# EAGLE design daughter-double2 (EAGLE 6.6.0)
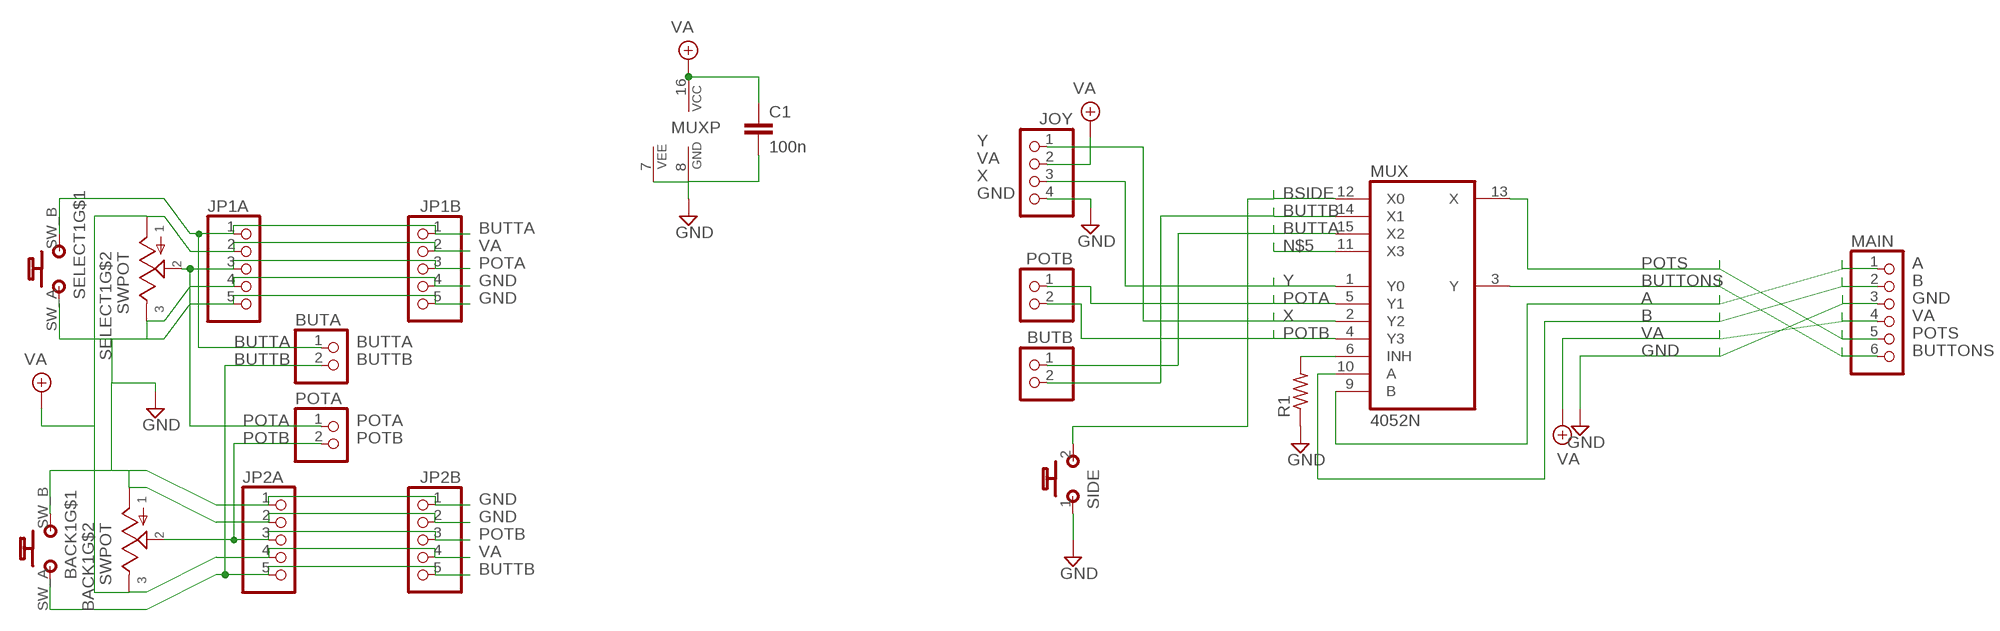
[diagram p0: schematic, sheet 1]

## Parts
BACK1  SWPOT  [SWPOT]
BUTA  PINHD-1X2  [1X02]
BUTB  PINHD-1X2  [1X02]
C1  100n  050X030_050  [050X030_050_3]
JOY  PINHD-1X4  [1X04]
JP1A  PINHD-1X5  [1X05]
JP1B  PINHD-1X5  [1X05]
JP2A  PINHD-1X5  [1X05]
JP2B  PINHD-1X5  [1X05]
MAIN  PINHD-1X6  [1X06]
MUX  4052N  [DIL16]
POTA  PINHD-1X2  [1X02]
POTB  PINHD-1X2  [1X02]
R1  6MM.1  [R0207/1V]
SELECT1  SWPOT  [SWPOT]
SIDE  MOMENTARYSPST1  [SPST]

## Nets
A: MAIN.1 MUX.9(B)
B: MAIN.2 MUX.10(A)
BSIDE: MUX.12(X0) SIDE.2(S)
BUTTA: BUTA.1 BUTB.1 JP1A.1 JP1B.1 MUX.15(X2) SELECT1.SW_B(B_B)
BUTTB: BACK1.SW_A(B_A) BUTA.2 BUTB.2 JP2A.5 JP2B.5 MUX.14(X1)
BUTTONS: MAIN.6 MUX.3(Y)
GND: BACK1.POT_B BACK1.SW_B(B_B) C1.2 JOY.4 JP1A.4 JP1A.5 JP1B.4 JP1B.5 JP2A.1 JP2A.2 JP2B.1 JP2B.2 MAIN.3 MUX.7(VEE) MUX.8(GND) R1.1 SELECT1.POT_A SELECT1.SW_A(B_A) SIDE.1(P)
N$5: MUX.11(X3)
N$6: MUX.6(INH) R1.2
POTA: JP1A.3 JP1B.3 MUX.5(Y1) POTA.1 POTB.1 SELECT1.POT_W
POTB: BACK1.POT_W JP2A.3 JP2B.3 MUX.4(Y3) POTA.2 POTB.2
POTS: MAIN.5 MUX.13(X)
VA: BACK1.POT_A C1.1 JOY.2 JP1A.2 JP1B.2 JP2A.4 JP2B.4 MAIN.4 MUX.16(VCC) SELECT1.POT_B
X: JOY.1 MUX.2(Y2)
Y: JOY.3 MUX.1(Y0)

## Library data of the parts
BACK1 SELECT1 = jaapie:SWPOT
BUTA BUTB POTA POTB = pinhead:PINHD-1X2: PIN HEADER
C1 = gm-caps-ceramic:050X030_050: 120 - 150pF Xicon Ceramic Disc 5mm lead spacing
JOY = pinhead:PINHD-1X4: PIN HEADER
JP1A JP1B JP2A JP2B = pinhead:PINHD-1X5: PIN HEADER
MAIN = pinhead:PINHD-1X6: PIN HEADER
MUX = 40xx:4052: Dual 4-channel ANALOG MULTIPLEXER
R1 = gm-resistors:6MM: 6mm Resistors Leads spaced 1-6 holes apart for 0.1" perfboard. Suitable for 1/4 watt resistors.
SIDE = gm-switches:MOMENTARY

## Board
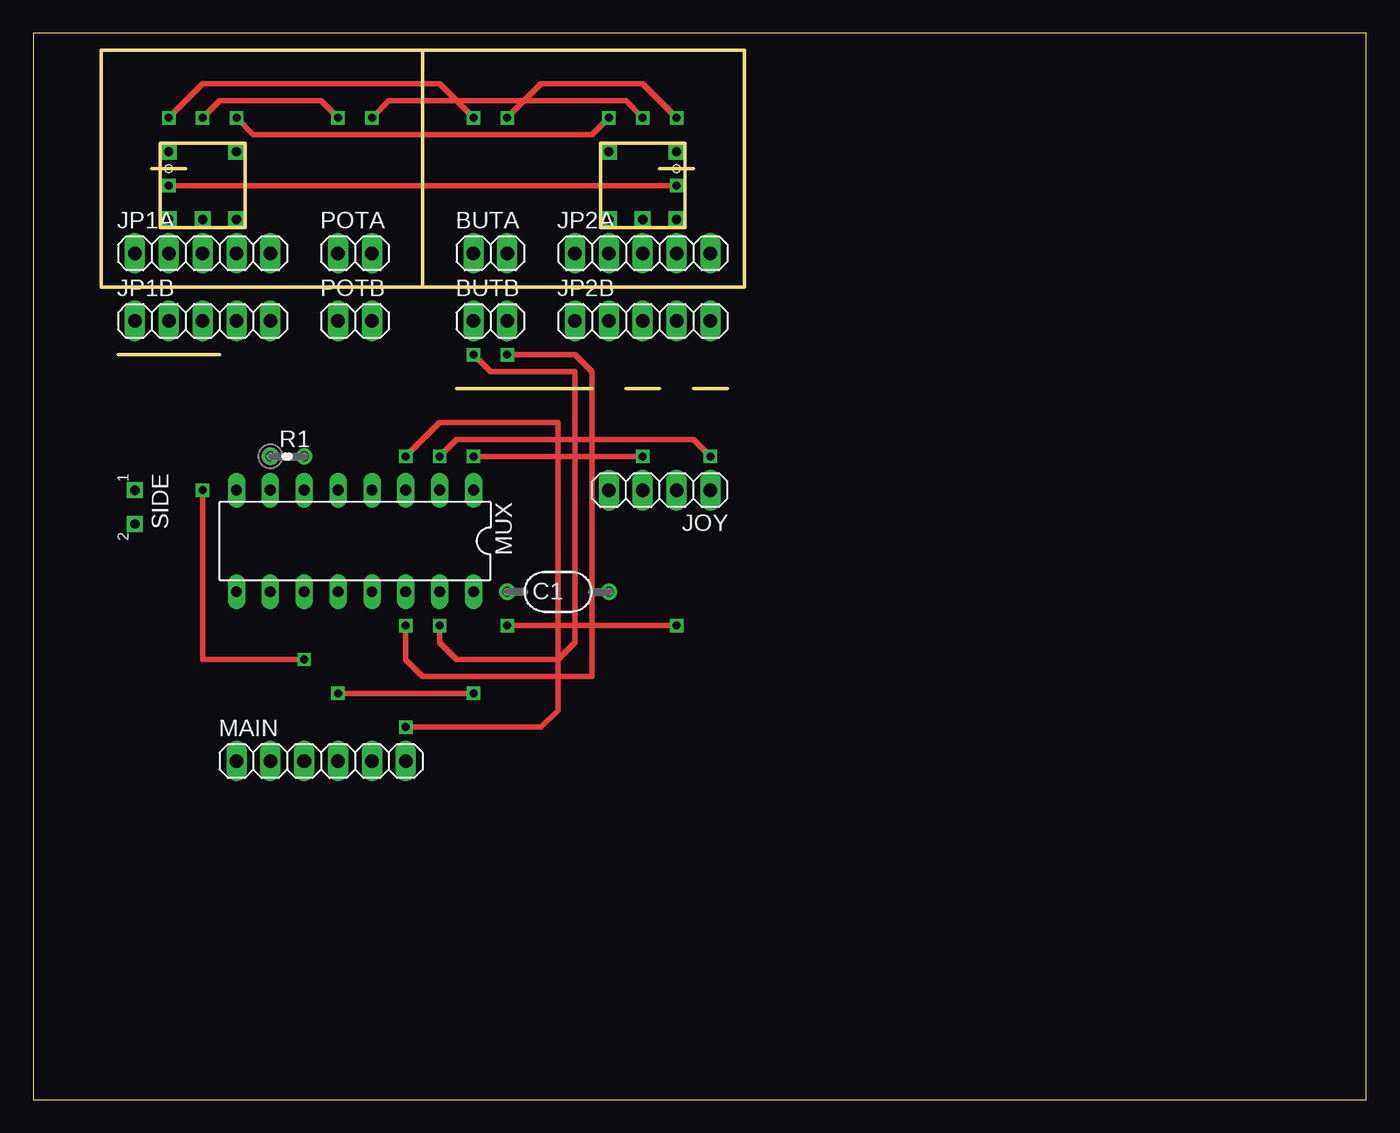
[diagram p1: board, top side]
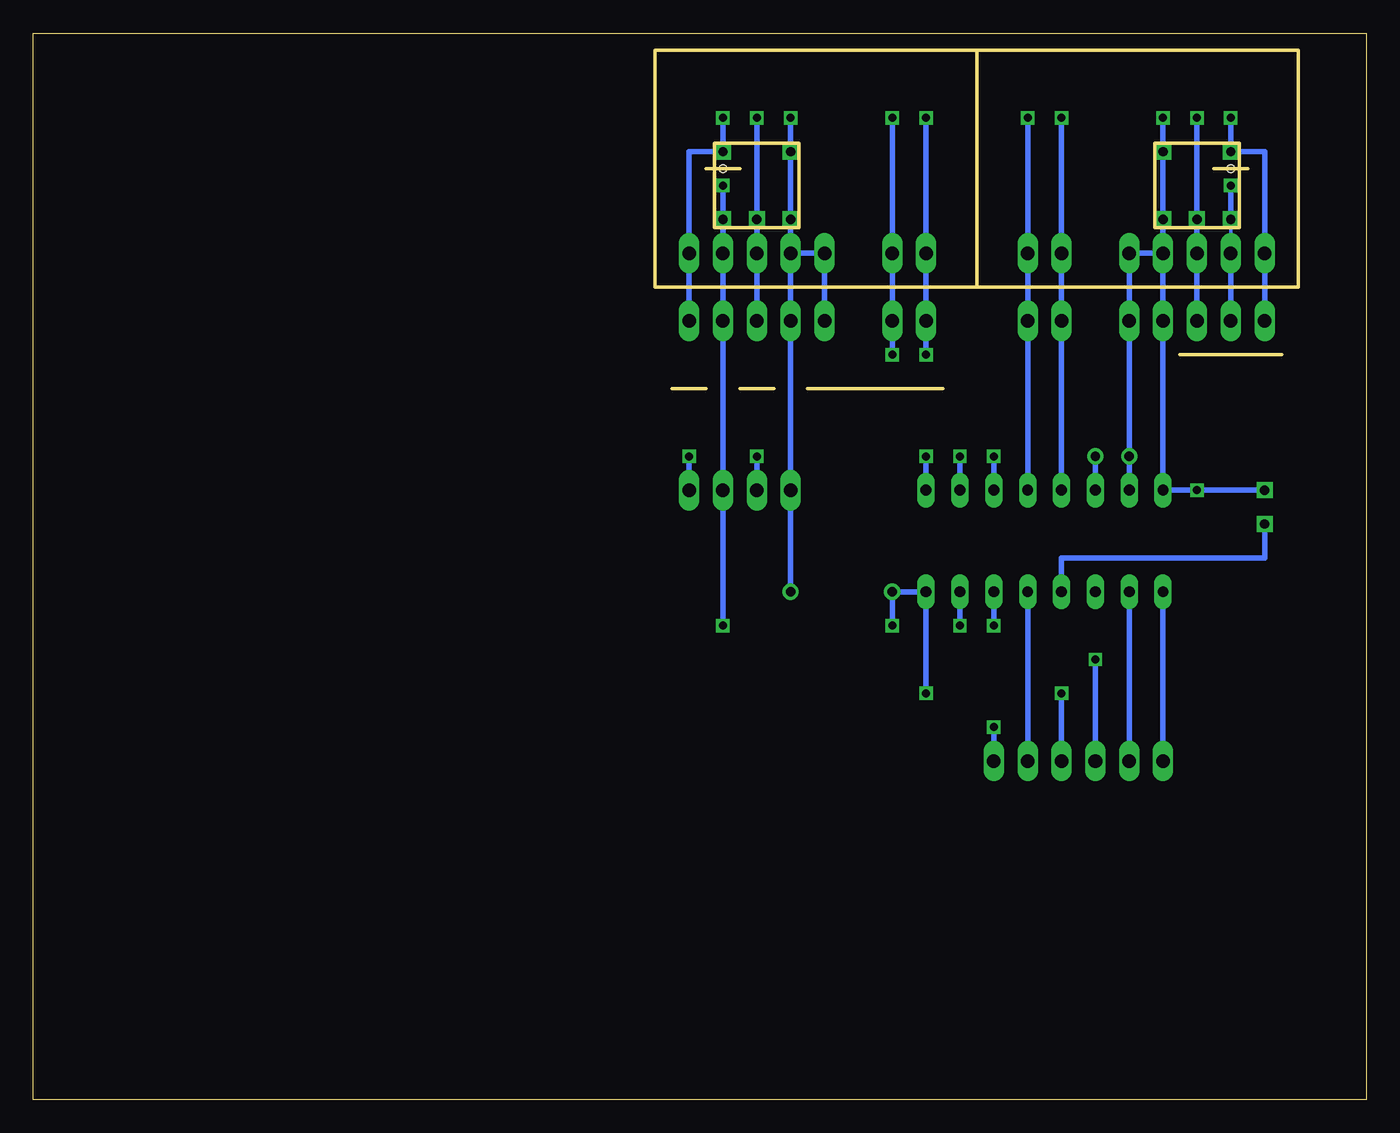
[diagram p2: board, bottom side, seen from below]

Size 100 x 80 mm. Coordinates in mm from the lower left corner, seen from the top.
Outline: 29.21,60.96 5.08,60.96 5.08,78.74 29.21,78.74
Outline: 29.21,60.96 53.34,60.96 53.34,78.74 29.21,78.74
Outline: 29.21,78.74 29.21,60.96
Outline: 8.89,69.85 11.43,69.85
Outline: 46.99,69.85 49.53,69.85
Outline: 6.35,55.88 13.97,55.88
Outline: 31.75,53.34 41.91,53.34
Outline: 44.45,53.34 46.99,53.34
Outline: 49.53,53.34 52.07,53.34
Outline: 0,0 100,0 100,80 0,80 0,0
Outline: 9.53,71.75 9.53,65.41 15.88,65.41 15.88,71.75 9.53,71.75
Outline: 42.55,71.75 48.9,71.75 48.9,65.41 42.55,65.41 42.55,71.75
Copper layers (1*16): Top 0.035mm / dielectric 1.5mm / Bottom 0.035mm
Design rules "default": minimum track width 10mil, minimum drill 24mil, track to track 8mil, track to pad 8mil, pad to pad 8mil, via to via 8mil, smd to smd 8mil, copper to edge 40mil, drill to drill 8mil, minimum pad ring 10mil, minimum via ring 8mil, stop-mask expansion 4mil, vias tented up to drill 0mil, thermal gap 10mil
Holes 0.6 mm at 10.16,69.85 48.26,69.85

### Footprints (pad centres in the part's own frame; a part is rotated, then mirrored left to right if it is on the bottom)
SWPOT = drill 0.7 square: POT_A -2.54,0; POT_B 2.54,0; POT_W 0,0; SW_A -2.54,-5.08; SW_B 2.54,-5.08
1X02 = drill 1.016 long: 1 -1.27,0; 2 1.27,0
050X030_050_3 = drill 0.7: 1 -3.81,0; 2 3.81,0
1X04 = drill 1.016 long: 1 -3.81,0; 2 -1.27,0; 3 1.27,0; 4 3.81,0
1X05 = drill 1.016 long: 1 -5.08,0; 2 -2.54,0; 3 0,0; 4 2.54,0; 5 5.08,0
1X06 = drill 1.016 long: 1 -6.35,0; 2 -3.81,0; 3 -1.27,0; 4 1.27,0; 5 3.81,0; 6 6.35,0
DIL16 = drill 0.813 long: 1 -8.89,-3.81; 2 -6.35,-3.81; 3 -3.81,-3.81; 4 -1.27,-3.81; 5 1.27,-3.81; 6 3.81,-3.81; 7 6.35,-3.81; 8 8.89,-3.81; 9 8.89,3.81; 10 6.35,3.81; 11 3.81,3.81; 12 1.27,3.81; 13 -1.27,3.81; 14 -3.81,3.81; 15 -6.35,3.81; 16 -8.89,3.81
R0207/1V = drill 0.7: 1 -1.27,0; 2 1.27,0
SPST = drill 0.7 square: 1 -1.27,0; 2 1.27,0

### Placement (x,y rotation side)
BACK1  45.72,66.04 180 top
BUTA  34.29,63.5 0 top
BUTB  34.29,58.42 0 top
C1  39.37,38.1 0 top
JOY  46.99,45.72 180 top
JP1A  12.7,63.5 0 top
JP1B  12.7,58.42 0 top
JP2A  45.72,63.5 0 top
JP2B  45.72,58.42 0 top
MAIN  21.59,25.4 0 top
MUX  24.13,41.91 180 top
POTA  24.13,63.5 0 top
POTB  24.13,58.42 0 top
R1  19.05,48.26 0 top
SELECT1  12.7,66.04 180 top
SIDE  7.62,44.45 270 top

### Tracks (layer width: path | path; a pad name or v marks a point on that pad's centre or on a via)
A
  Bottom 0.406: MUX.9 MAIN.1
B
  Bottom 0.406: MUX.10 MAIN.2
BSIDE
  Bottom 0.406: SIDE.2 7.62,40.64 22.86,40.64 MUX.12
BUTTA  (via drill 0.6)
  Top 0.406: v10.16,73.66 12.7,76.2 30.48,76.2 v33.02,73.66 | v33.02,55.88 34.29,54.61 40.64,54.61 40.64,34.29 39.37,33.02 31.75,33.02 30.48,34.29 v30.48,35.56
  Bottom 0.406: v10.16,73.66 SELECT1.SW_B 7.62,71.12 JP1A.1 JP1B.1 | v33.02,73.66 BUTA.1 BUTB.1 v33.02,55.88 | v30.48,35.56 MUX.15
BUTTB  (via drill 0.6)
  Top 0.406: v35.56,73.66 38.1,76.2 45.72,76.2 v48.26,73.66 | v35.56,55.88 40.64,55.88 41.91,54.61 41.91,31.75 29.21,31.75 27.94,33.02 v27.94,35.56
  Bottom 0.406: v35.56,73.66 BUTA.2 BUTB.2 v35.56,55.88 | v48.26,73.66 BACK1.SW_A 50.8,71.12 JP2A.5 JP2B.5 | v27.94,35.56 MUX.14
BUTTONS  (via drill 0.6)
  Top 0.406: v27.94,27.94 38.1,27.94 39.37,29.21 39.37,50.8 30.48,50.8 v27.94,48.26
  Bottom 0.406: MUX.3 v27.94,48.26 | v27.94,27.94 MAIN.6
GND  (via drill 0.6)
  Top 0.406: v15.24,73.66 16.51,72.39 41.91,72.39 v43.18,73.66 | v20.32,33.02 12.7,33.02 v12.7,45.72
  Bottom 0.406: SELECT1.SW_A SELECT1.POT_A JP1A.4 | JP2A.2 BACK1.POT_B BACK1.SW_B v43.18,73.66 | JP1A.4 JP1A.5 JP1B.5 R1.1 MUX.7 | JP1A.4 SELECT1.SW_A | SELECT1.SW_A v15.24,73.66 | JP2A.2 JP2A.1 JP2B.1 | JP2A.2 JP2B.2 JOY.4 C1.2 | JP1A.4 JP1B.4 MUX.8 v12.7,45.72 SIDE.1 | MAIN.3 v20.32,33.02
N$6
  Bottom 0.406: R1.2 MUX.6
POTA  (via drill 0.6)
  Top 0.406: v12.7,73.66 13.97,74.93 21.59,74.93 v22.86,73.66
  Bottom 0.406: JP1A.3 SELECT1.POT_W | JP1A.3 v12.7,73.66 | v22.86,73.66 POTA.1 POTB.1 MUX.5 | JP1A.3 JP1B.3
POTB  (via drill 0.6)
  Top 0.406: v25.4,73.66 26.67,74.93 44.45,74.93 v45.72,73.66
  Bottom 0.406: v25.4,73.66 POTA.2 POTB.2 MUX.4 | v45.72,73.66 BACK1.POT_W JP2A.3 JP2B.3
POTS
  Bottom 0.406: MUX.13 MAIN.5
VA  (via drill 0.6)
  Top 0.406: v10.16,68.58 v48.26,68.58 | v48.26,35.56 v35.56,35.56 | v22.86,30.48 v33.02,30.48
  Bottom 0.254: JP1A.2 SELECT1.POT_B
  Bottom 0.406: SELECT1.POT_B v10.16,68.58 | v48.26,68.58 BACK1.POT_A JP2A.4 JP2B.4 JOY.2 v48.26,35.56 | JP1A.2 JP1B.2 | v35.56,35.56 C1.1 MUX.16 v33.02,30.48 | MAIN.4 v22.86,30.48
X  (via drill 0.6)
  Top 0.406: v30.48,48.26 31.75,49.53 49.53,49.53 v50.8,48.26
  Bottom 0.406: JOY.1 v50.8,48.26 | v30.48,48.26 MUX.2
Y  (via drill 0.6)
  Top 0.406: v45.72,48.26 v33.02,48.26
  Bottom 0.406: JOY.3 v45.72,48.26 | v33.02,48.26 MUX.1